# EasyEDA Pro project Pajero Gauges.epro, board PCB
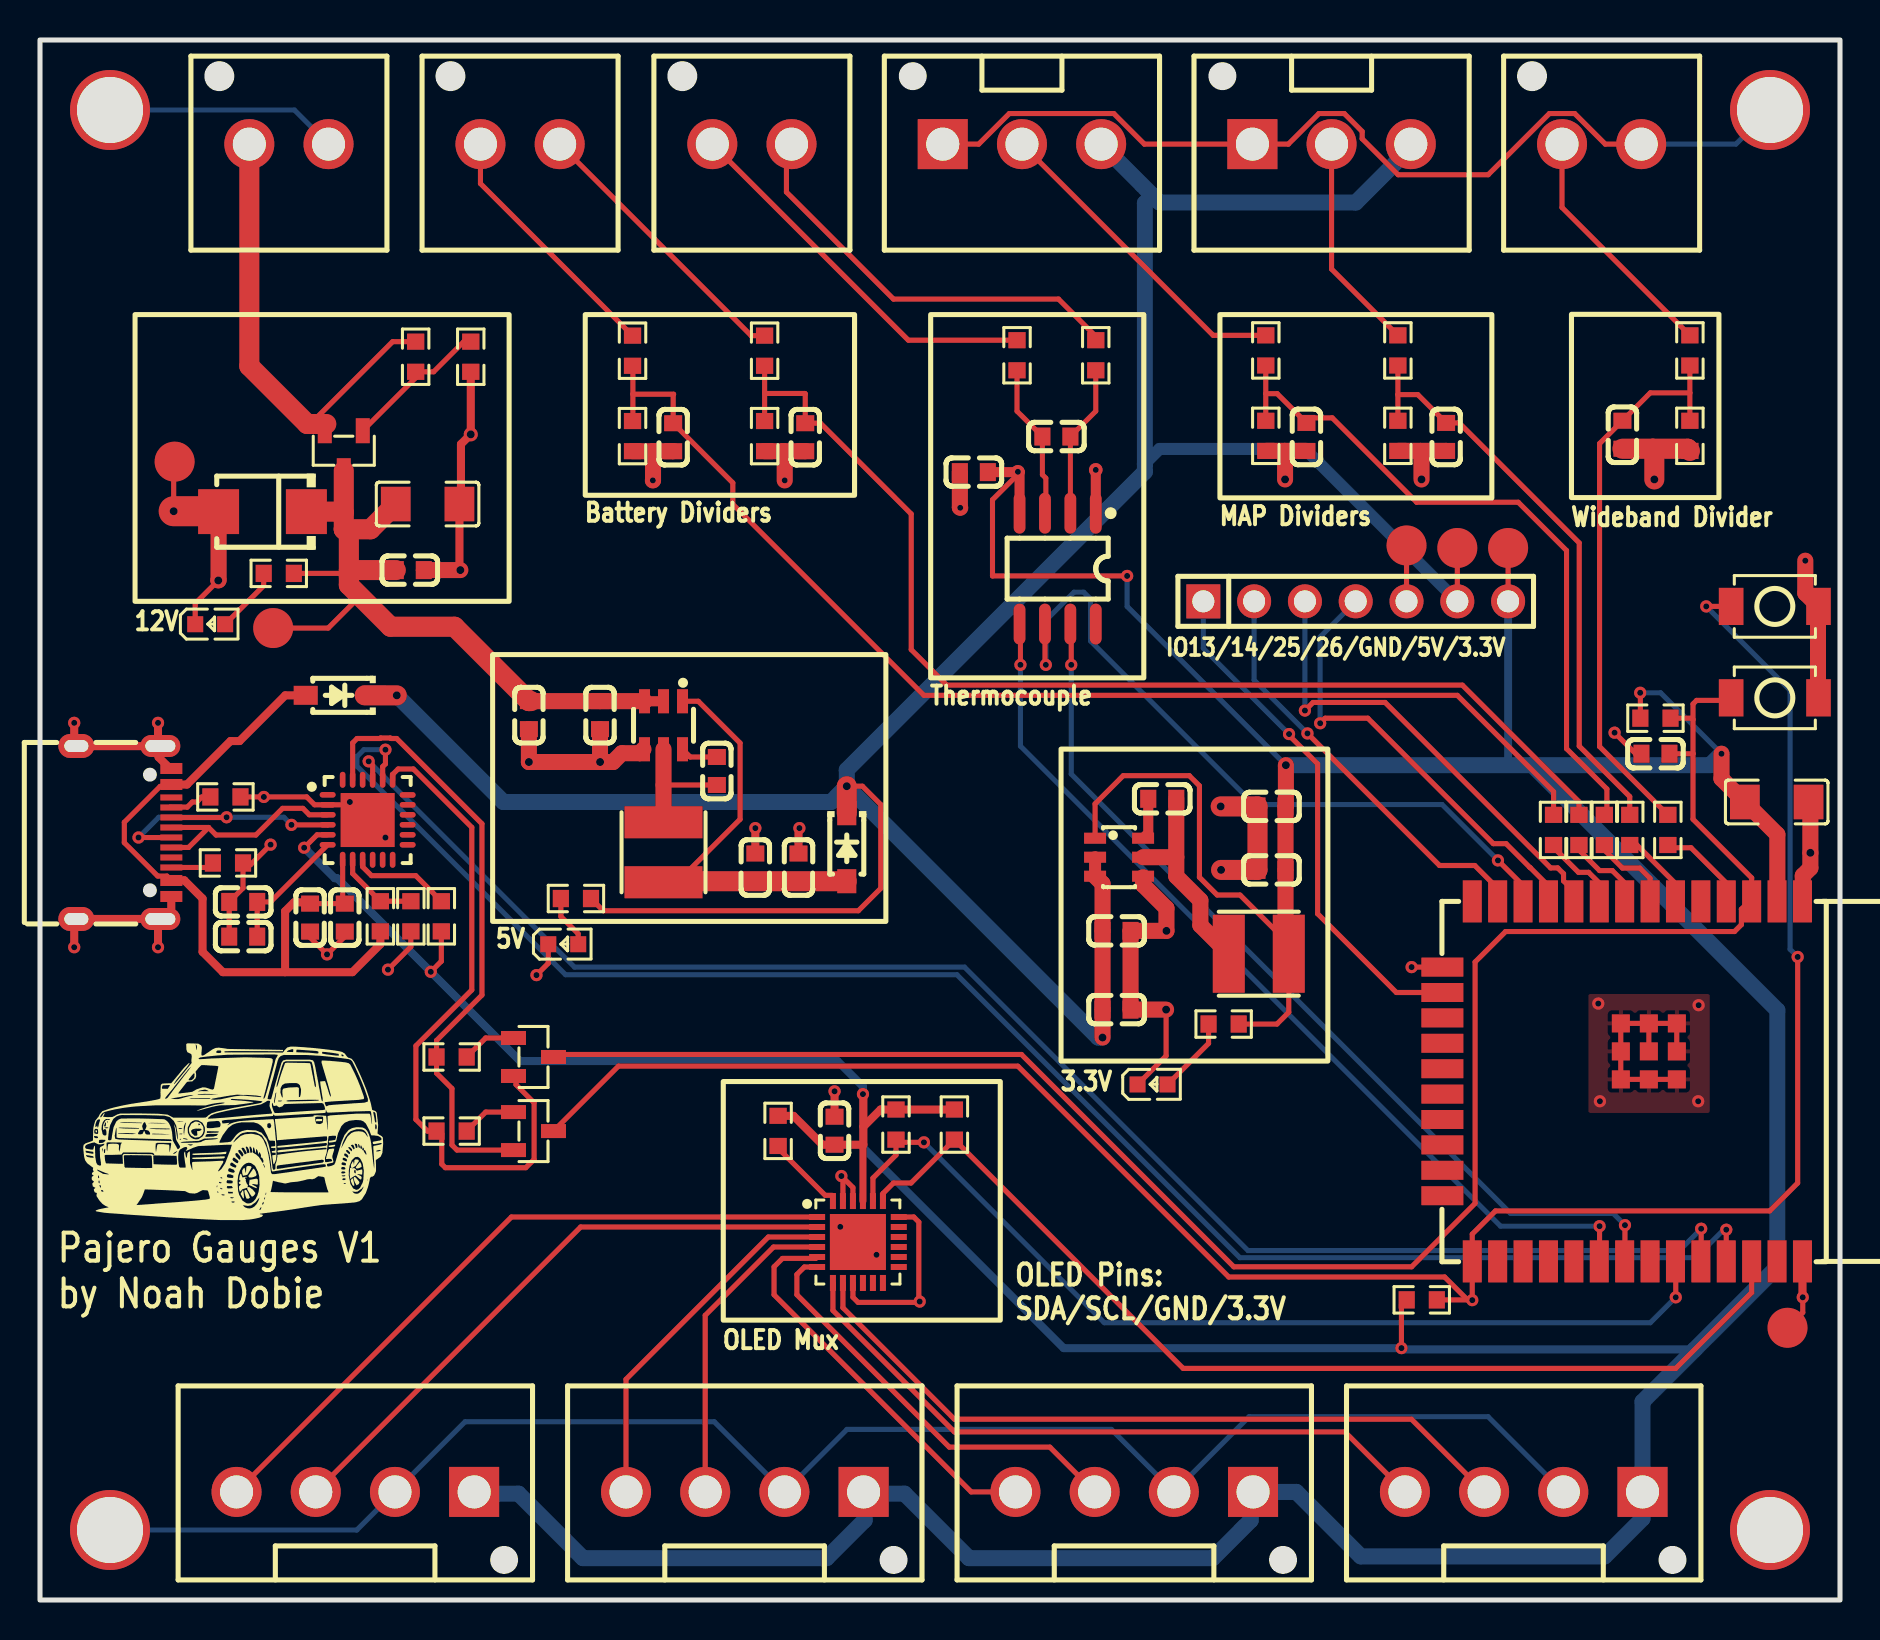
[diagram p18: board, top side]
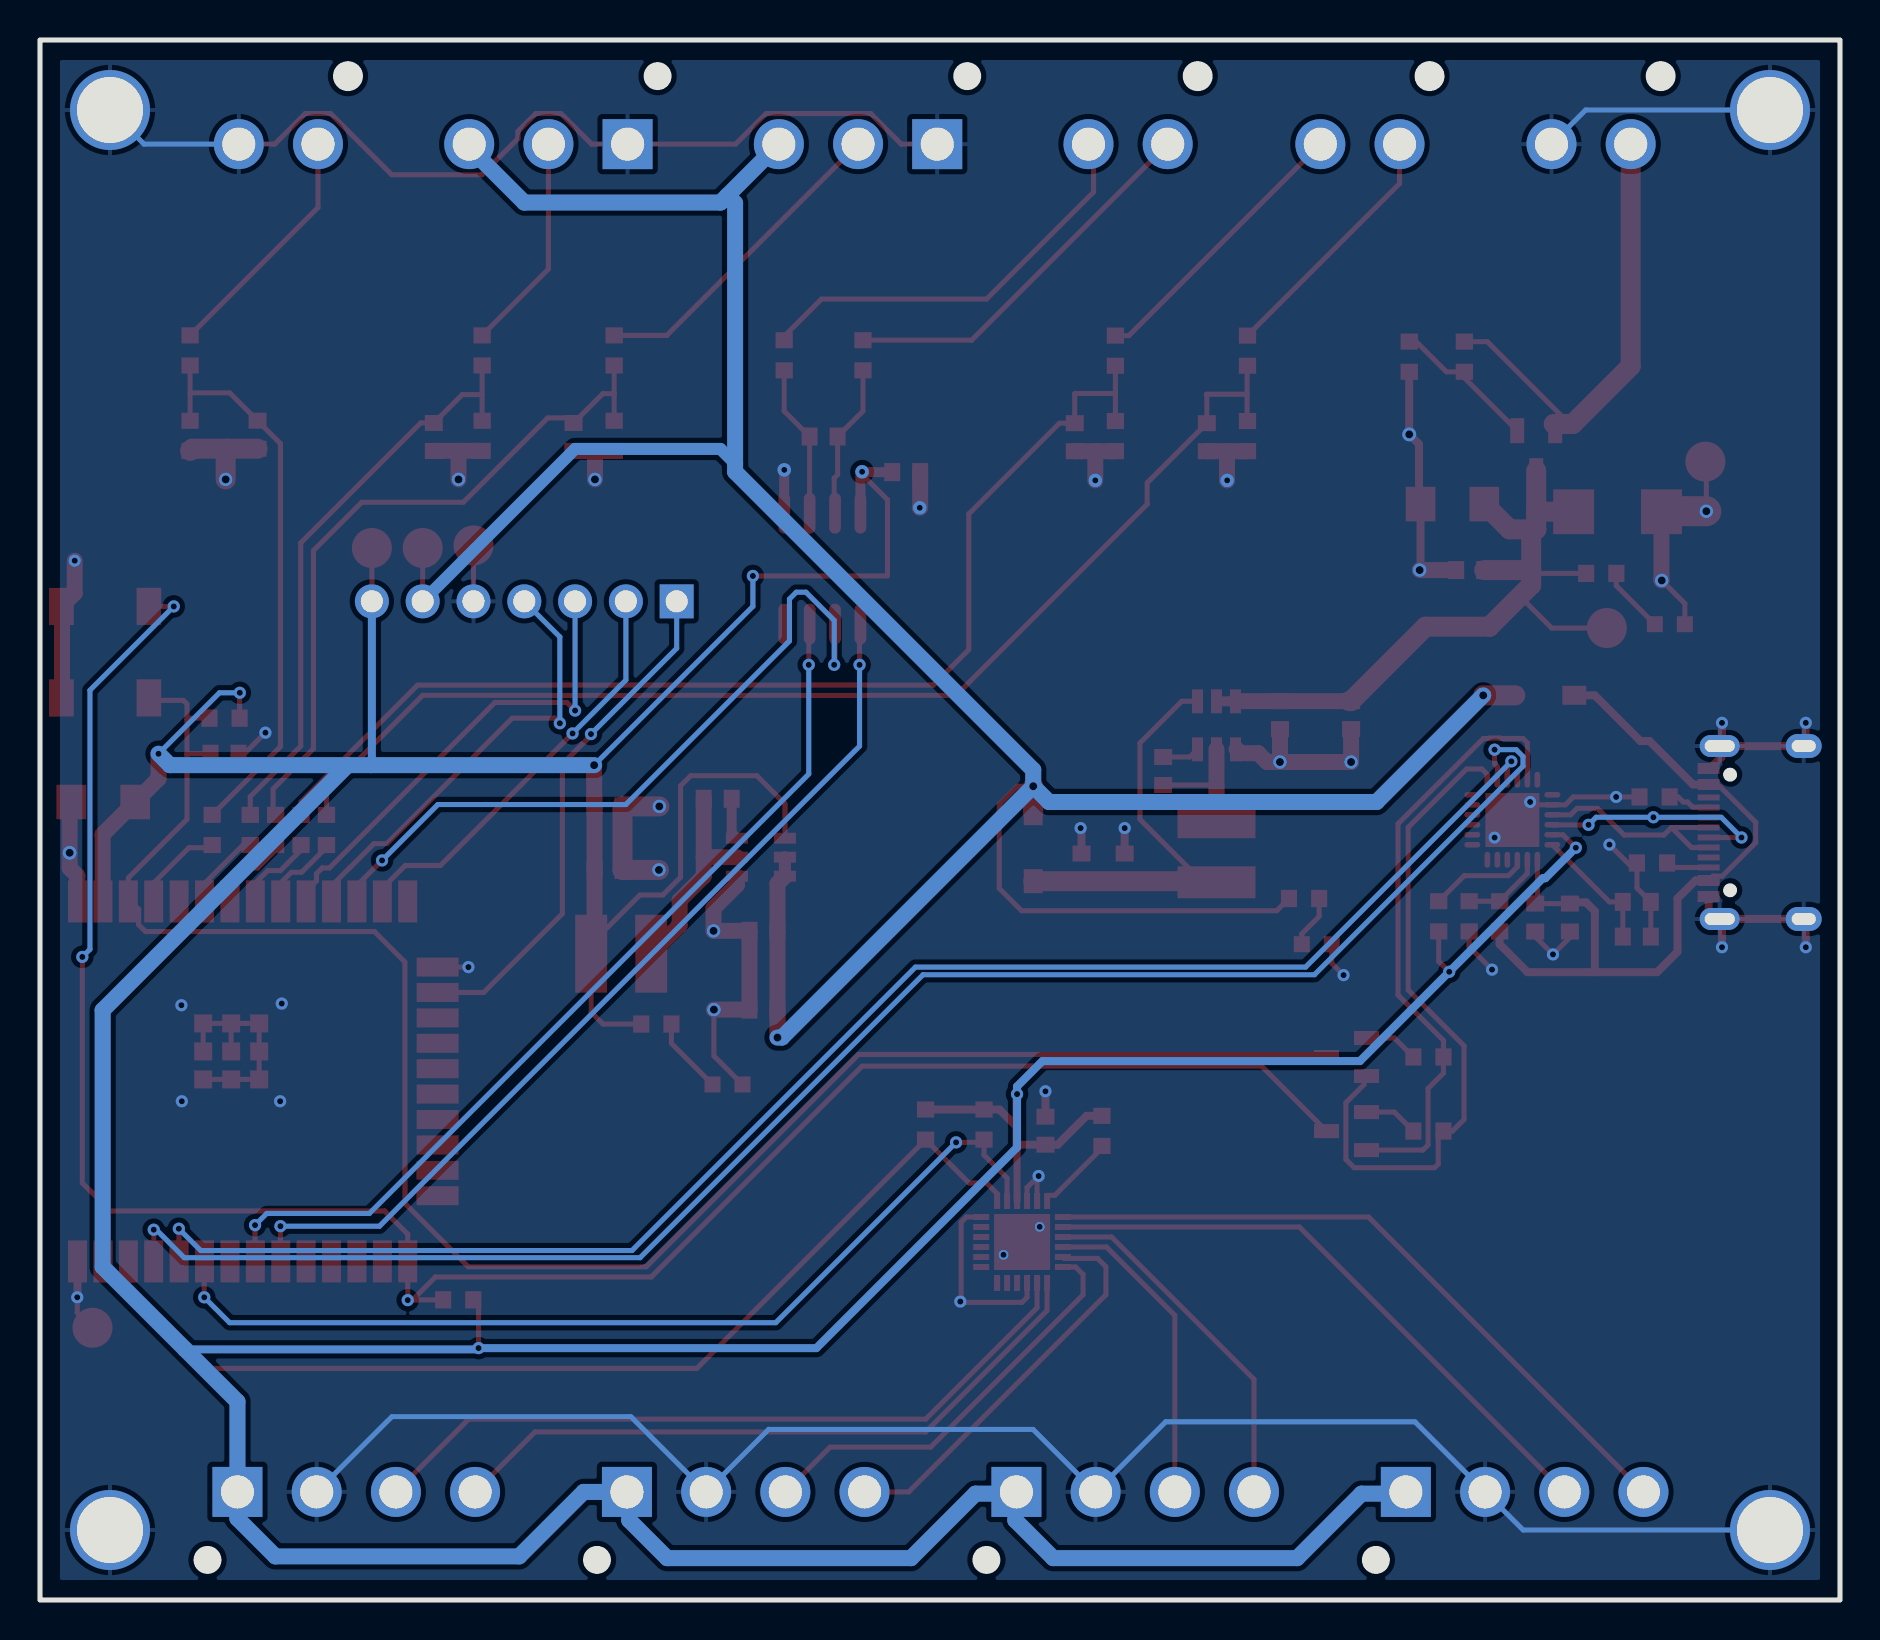
[diagram p19: board, bottom side, seen from below]

Outline 90 x 78 mm; copper layers: Top Layer, Bottom Layer. Coordinates in mm from the lower left corner of the outline.
Outline path: rectangle 0,78 90,0
Stack: Top Layer 0.035mm / Dielectric1 1.51mm FR4 er 4.5 / Bottom Layer 0.035mm

## Design rules (mm)
template: JLCPCB Capability(Two Layers Board)
spacing copperThickness1oz (default): track to track 0.102, other pairs 0.152 to 0.3
spacing copperThickness2oz: track to track 0.203, other pairs 0.152 to 0.3
track width copperThickness1oz (default): min 0.127, default 0.254, max 2.54
track width copperThickness2oz: min 0.203, default 0.254, max 2.54
differential pair differentialPair (default): width min 0.127, default 0.254, max 2.54; gap min 0.152, default 0.152
via viaSize (default): diameter min 0.5, default 0.61, max 10; hole min 0.3, default 0.305, max 6.3
net BATT_PROT uses copperThickness2oz
net IGN_12V uses copperThickness2oz
net TC+ uses copperThickness2oz
net TC- uses copperThickness2oz
net WB_OUT uses copperThickness2oz
net BATT1_IN uses copperThickness2oz
net BATT2_IN uses copperThickness2oz
net MAP1_SIGNAL_OUT uses copperThickness2oz
net MAP2_SIGNAL_OUT uses copperThickness2oz

## Placement (name value [footprint] x y rotation side)
C11  100nF  [C0603]  31.66 58.14 90 top
C12  100nF  [C0603]  38.26 58.14 90 top
C13  100nF  [C0603]  63.32 58.15 90 top
C14  100nF  [C0603]  70.31 58.15 90 top
C28  100uF  [C1206]  86.84 39.9 0 top
C31  100uF  [C1206]  19.38 54.8 0 top
C32  100nF  [C0603]  18.49 51.5 180 top
C33  100nF  [C0603]  56.11 40.06 180 top
C34  22uF  [C0603]  61.57 36.5 0 top
C35  22uF  [C0603]  61.57 39.68 180 top
C36  100nF  [C0603]  53.83 29.52 180 top
C37  100nF  [C0603]  53.83 33.46 180 top
C38  100nF  [C0603]  33.84 41.45 90 top
C39  22uF  [C0603]  35.77 36.62 270 top
C40  22uF  [C0603]  37.93 36.62 90 top
C41  100nF  [C0603]  24.44 44.24 90 top
C42  100nF  [C0603]  28 44.24 90 top
C43  10nF  [C0603]  50.82 58.17 0 top
C44  100nF  [C0603]  46.69 56.39 0 top
C49  100nF  [C0603]  79.12 58.26 90 top
C50  100nF  [C0603]  39.73 23.46 90 top
C51  1uF  [C0603]  80.77 42.31 180 top
C53  100nF  [C0603]  13.5 34.12 90 top
C54  4.7uF  [C0603]  15.24 34.12 90 top
C55  100nF  [C0603]  10.16 33.17 180 top
C56  4.7uF  [C0603]  10.16 34.9 180 top
D2  SMBJ58A  [SMB_L4.4-W3.6-LS5.2-RD]  11.12 54.42 180 top
D3  B5819W-G  [SOD-123_L2.7-W1.6-LS3.7-RD-1]  40.34 37.64 270 top
D4  B5819W-G  [SOD-123_L2.7-W1.6-LS3.7-RD-1]  14.99 45.23 180 top
ESP32  ESP32-WROOM-32E-N4  [WIFI-SMD_ESP32-WROOM-32E]  79.12 25.93 180 top
H1  B2P-VH-FB-B(LF)(SN)  [CONN-TH_2P-P3.96_B2P-VH-FB-B-LF-SN]  12.45 72.79 0 top
H3  B2P-VH-FB-B(LF)(SN)  [CONN-TH_2P-P3.96_B2P-VH-FB-B-LF-SN]  24 72.79 0 top
H4  B3P-VH-FB-B(LF)(SN)  [CONN-TH_B3P-VH-FB-B-LF-SN]  49.1 72.79 180 top
H5  B3P-VH-FB-B(LF)(SN)  [CONN-TH_B3P-VH-FB-B-LF-SN]  64.58 72.79 180 top
H6  B2P-VH-FB-B(LF)(SN)  [CONN-TH_2P-P3.96_B2P-VH-FB-B-LF-SN]  35.6 72.79 0 top
H7  B2P-VH-FB-B(LF)(SN)  [CONN-TH_2P-P3.96_B2P-VH-FB-B-LF-SN]  78.08 72.79 0 top
H8  B4P-VH-FB-B(LF)(SN)  [CONN-TH_B4P-VH-FB-B-LF-SN]  15.77 5.4 0 top
H9  B4P-VH-FB-B(LF)(SN)  [CONN-TH_B4P-VH-FB-B-LF-SN]  35.24 5.4 0 top
H10  B4P-VH-FB-B(LF)(SN)  [CONN-TH_B4P-VH-FB-B-LF-SN]  54.71 5.4 0 top
H11  B4P-VH-FB-B(LF)(SN)  [CONN-TH_B4P-VH-FB-B-LF-SN]  74.19 5.4 0 top
L4  4.7uH  [IND-SMD_L4.0-W4.0_FNR40XXS]  60.94 32.31 0 top
L5  4.7uH  [IND-SMD_L4.0-W4.0_FNR40XXS]  31.18 37.39 270 top
LED1  KT-0603R  [LED0603-RD]  8.51 48.79 0 top
LED2  KT-0603B  [LED0603-RD]  26.16 32.79 0 top
LED3  KT-0603G  [LED0603-RD]  55.63 25.78 0 top
NOREF  -  [Pad_e464]  6.73 56.92 0 top
NOREF#2  -  [Pad_e1928]  3.5 3.5 180 top
NOREF#3  -  [Pad_e454]  87.38 13.61 0 top
NOREF#4  -  [Pad_e1926]  86.5 74.5 0 top
NOREF#5  -  [Pad_e157]  3.5 74.5 90 top
NOREF#6  -  [Pad_e472]  70.87 52.6 0 top
NOREF#7  -  [Pad_e468]  68.33 52.73 0 top
NOREF#8  -  [Pad_e473]  73.41 52.6 0 top
NOREF#9  -  [Pad_e476]  11.66 48.6 0 top
NOREF#10  -  [Pad_e1927]  86.5 3.5 270 top
Q2  AO3401A  [SOT-23-3_L2.9-W1.3-P1.90-LS2.4-BR]  15.19 57.46 90 top
Q3  S8050  [SOT-23-3_L2.9-W1.3-P1.90-LS2.4-BR]  24.67 27.15 180 top
Q4  S8050  [SOT-23-3_L2.9-W1.3-P1.90-LS2.4-BR]  24.67 23.45 180 top
R4  1kΩ  [R0603]  79.49 38.5 270 top
R5  1kΩ  [R0603]  78.22 38.5 270 top
R6  1kΩ  [R0603]  76.95 38.5 270 top
R7  1kΩ  [R0603]  75.68 38.5 270 top
R9  100kΩ  [R0603]  21.54 62.16 90 top
R10  100kΩ  [R0603]  18.78 62.16 270 top
R11  100kΩ  [R0603]  52.79 62.24 270 top
R12  100kΩ  [R0603]  48.85 62.24 270 top
R13  1kΩ  [R0603]  81.39 38.5 270 top
R14  10kΩ  [R0603]  36.9 23.45 90 top
R15  4.7kΩ  [R0603]  42.8 23.77 270 top
R16  4.7kΩ  [R0603]  45.72 23.77 270 top
R17  10kΩ  [R0603]  80.77 44.09 180 top
R100  10kΩ  [R0603]  82.49 62.48 90 top
R101  20kΩ  [R0603]  82.49 58.21 90 top
R102  27kΩ  [R0603]  29.63 62.46 90 top
R103  5.1kΩ  [R0603]  29.63 58.19 90 top
R104  27kΩ  [R0603]  36.23 62.46 90 top
R105  5.1kΩ  [R0603]  36.23 58.19 90 top
R106  10kΩ  [R0603]  61.29 62.48 90 top
R107  20kΩ  [R0603]  61.29 58.21 90 top
R108  10kΩ  [R0603]  67.89 62.48 90 top
R109  20kΩ  [R0603]  67.89 58.21 90 top
R110  10kΩ  [R0603]  69.09 15.01 0 top
R111  4.7kΩ  [R0603]  11.94 51.33 180 top
R112  2.2kΩ  [R0603]  26.8 35.07 180 top
R113  1kΩ  [R0603]  59.18 28.8 180 top
R114  5.1kΩ  [R0603]  9.27 40.15 180 top
R115  5.1kΩ  [R0603]  9.4 36.85 0 top
R116  22.1kΩ  [R0603]  17.02 34.19 90 top
R117  47.5kΩ  [R0603]  18.54 34.19 90 top
R118  1kΩ  [R0603]  20.07 34.19 90 top
R119  12kΩ  [R0603]  20.58 27.15 0 top
R120  12kΩ  [R0603]  20.58 23.45 0 top
SW1  TS-1088-AR02016  [SW-SMD_L3.9-W3.0-P4.45]  86.74 45.11 0 top
SW2  TS-1088-AR02016  [SW-SMD_L3.9-W3.0-P4.45]  86.74 49.68 180 top
U10  AP63205WU-7  [TSOT-23-6_L2.9-W1.6-P0.95-LS2.8-BL]  31.18 43.74 180 top
U11  AP63203WU-7  [TSOT-26_L2.9-W1.6-P0.95-LS2.8-BL]  53.95 37.14 270 top
U12  MAX31855TASA+T  [SOIC-8_L4.9-W3.9-P1.27-LS6.2-BL]  50.88 51.57 180 top
U13  TCA9548ARGERQ1  [VQFN-24_L4.0-W4.0-P0.50-TL-EP2.8]  40.9 17.9 0 top
U14  CP2102N-A02-GQFN24R  [QFN-24_L4.0-W4.0-P0.50-TL-EP2.6]  16.38 39.01 0 top
U15  17-1442-002  [HDR-TH_7P-P2.54-V-M]  65.79 49.93 0 top
USB1  TYPE-C 16PIN 2MD(073)  [USB-C-SMD_TYPE-C-6PIN-2MD-073]  4.19 38.38 270 top

## Footprints (pads in the part's own frame, mm; a bottom-side part is the same pattern mirrored in y, then rotated)
C0603
  rect 0.8x0.9 smd: 1(-0.7,0) 2(0.7,0)
C1206
  rect 1.485x1.728 smd: 1(-1.593,0) 2(1.593,0)
CONN-TH_2P-P3.96_B2P-VH-FB-B-LF-SN
  round 2.5 hole 1.65: 1(-1.98,0) 2(1.98,0)
CONN-TH_B3P-VH-FB-B-LF-SN
  rect 2.5x2.5 hole 1.65: 1(3.96,0)
  round 2.5 hole 1.65: 2(0.001,0) 3(-3.96,0)
CONN-TH_B4P-VH-FB-B-LF-SN
  rect 2.5x2.5 hole 1.65: 1(5.94,0)
  round 2.5 hole 1.65: 2(1.98,0) 3(-1.98,0) 4(-5.94,0)
HDR-TH_7P-P2.54-V-M
  rect 1.7x1.7 hole 1.1: 1(-7.62,0)
  round 1.7 hole 1.1: 2(-5.08,0) 3(-2.54,0) 4(0,0) 5(2.54,0) 6(5.08,0) 7(7.62,0)
IND-SMD_L4.0-W4.0_FNR40XXS
  rect 1.6x3.9 smd: 1(-1.5,0) 2(1.5,0)
LED0603-RD
  rect 0.8x0.8 smd: 1(-0.749,0) 2(0.749,0)
Pad_e157
  round 4 hole 3.3: 1(0,0)
Pad_e454
  round 2 smd: 1(0,0)
Pad_e464
  round 2 smd: 1(0,0)
Pad_e468
  round 2 smd: 1(0,0)
Pad_e472
  round 2 smd: 1(0,0)
Pad_e473
  round 2 smd: 1(0,0)
Pad_e476
  round 2 smd: 1(0,0)
Pad_e1926
  round 4 hole 3.3: 1(0,0)
Pad_e1927
  round 4 hole 3.3: 1(0,0)
Pad_e1928
  round 4 hole 3.3: 1(0,0)
QFN-24_L4.0-W4.0-P0.50-TL-EP2.6
  oval 0.8x0.28 smd: 1(-2,1.25) 2(-2,0.75) 3(-2,0.25) 4(-2,-0.25) 5(-2,-0.75) 6(-2,-1.25) 13(2,-1.25) 14(2,-0.75) 15(2,-0.25) 16(2,0.25) 17(2,0.75) 18(2,1.242)
  oval 0.28x0.8 smd: 7(-1.25,-2) 8(-0.75,-2) 9(-0.25,-2) 10(0.25,-2) 11(0.75,-2) 12(1.25,-2) 19(1.25,2) 20(0.75,2) 21(0.25,2) 22(-0.25,2) 23(-0.75,2) 24(-1.25,2)
  rect 2.7x2.7 smd: 25(0,-0.013)
R0603
  rect 0.806x0.864 smd: 1(-0.753,0) 2(0.753,0)
SMB_L4.4-W3.6-LS5.2-RD
  rect 2.047x2.241 smd: 1(-2.195,0) 2(2.195,0)
SOD-123_L2.7-W1.6-LS3.7-RD-1
  rect 1.2x0.95 smd: 1(-1.7,0) 2(1.7,0)
SOIC-8_L4.9-W3.9-P1.27-LS6.2-BL
  oval 0.588x2.045 smd: 1(-1.905,-2.772) 2(-0.635,-2.772) 3(0.635,-2.772) 4(1.905,-2.772) 5(1.905,2.772) 6(0.635,2.772) 7(-0.635,2.772) 8(-1.905,2.772)
SOT-23-3_L2.9-W1.3-P1.90-LS2.4-BR
  rect 1.25x0.7 smd: 1(1,-0.95) 2(1,0.95) 3(-1,0)
SW-SMD_L3.9-W3.0-P4.45
  rect 1.23x1.86 smd: 1(-2.185,0) 2(2.185,0)
TSOT-23-6_L2.9-W1.6-P0.95-LS2.8-BL
  rect 0.55x1.2 smd: 1(-0.95,-1.2) 2(0,-1.2) 3(0.95,-1.2) 4(0.95,1.2) 5(0,1.2) 6(-0.95,1.2)
TSOT-26_L2.9-W1.6-P0.95-LS2.8-BL
  rect 0.55x1.1 smd: 1(-0.95,-1.2) 2(0,-1.2) 3(0.95,-1.2) 4(0.95,1.2) 5(0,1.2) 6(-0.95,1.2)
USB-C-SMD_TYPE-C-6PIN-2MD-073
  rect 0.55x1.1 smd: 1(-3.2,2.375) 2(-2.4,2.375) 11(2.4,2.375) 12(3.2,2.375)
  rect 0.3x1.1 smd: 3(-1.75,2.375) 4(-1.25,2.375) 5(-0.75,2.375) 6(-0.25,2.375) 7(0.25,2.375) 8(0.75,2.375) 9(1.25,2.375) 10(1.75,2.375)
  oval 1.1x2 hole 0.6x1.5: 13(-4.325,1.825) 14(4.325,1.825)
  oval 1.2x1.8 hole 0.6x1.2: 13(-4.325,-2.375) 14(4.325,-2.375)
VQFN-24_L4.0-W4.0-P0.50-TL-EP2.8
  rect 0.8x0.3 smd: 1(-2.042,1.25) 2(-2.042,0.75) 3(-2.042,0.25) 4(-2.042,-0.25) 5(-2.042,-0.75) 6(-2.042,-1.25) 13(2.042,-1.25) 14(2.042,-0.75) 15(2.042,-0.25) 16(2.042,0.25) 17(2.042,0.75) 18(2.042,1.25)
  rect 0.3x0.8 smd: 7(-1.25,-2.048) 8(-0.75,-2.048) 9(-0.25,-2.048) 10(0.249,-2.048) 11(0.75,-2.048) 12(1.25,-2.048) 19(1.25,2.048) 20(0.75,2.048) 21(0.249,2.048) 22(-0.25,2.048) 23(-0.75,2.048) 24(-1.25,2.048)
  rect 2.8x2.8 smd: 25(-0.001,-0.001)
WIFI-SMD_ESP32-WROOM-32E
  rect 0.95x2.1 smd: 1(-9.002,-9) 2(-7.732,-9) 3(-6.463,-9) 4(-5.192,-9) 5(-3.922,-9) 6(-2.652,-9) 7(-1.383,-9) 8(-0.113,-9) 9(1.157,-9) 10(2.428,-9) 11(3.697,-9) 12(4.968,-9) 13(6.237,-9) 14(7.508,-9) 25(7.508,9) 26(6.237,9) 27(4.968,9) 28(3.697,9) 29(2.428,9) 30(1.157,9) 31(-0.113,9) 32(-1.383,9) 33(-2.652,9) 34(-3.922,9) 35(-5.192,9) 36(-6.463,9) 37(-7.732,9) 38(-9.002,9)
  rect 2.1x0.95 smd: 15(9.002,-5.715) 16(9.002,-4.445) 17(9.002,-3.175) 18(9.002,-1.905) 19(9.002,-0.635) 20(9.002,0.635) 21(9.002,1.905) 22(9.002,3.175) 23(9.002,4.445) 24(9.002,5.715)
  rect 0.9x0.9 smd: 39(-2.721,-0.1) 39(-2.721,-1.5) 39(-2.721,-2.9) 39(-1.321,-0.1) 39(-1.321,-1.5) 39(-1.321,-2.9) 39(0.079,-0.1) 39(0.079,-1.5) 39(0.079,-2.9)

## Nets
As in the schematic, except:
+3.3V: C28.1 C34.2 C35.1 C44.2 C50.1 ESP32.2 H8.1 H9.1 H10.1 H11.1 L4.2 NOREF#8.1 R14.2 R15.1 R16.1 R17.2 R110.1 R113.1 R118.1 U11.1 U12.4 U13.21 U14.5 U15.7
+5V_RAIL: C36.2 C37.2 D3.1 D4.1 H4.3 H5.3 NOREF#6.1 R112.1 U11.2 U11.3 U15.6
PGND: C11.1 C12.1 C13.1 C14.1 C28.2 C31.2 C32.1 C34.1 C35.2 C36.1 C37.1 C39.1 C40.2 C41.1 C42.1 C44.1 C49.1 C50.2 C51.2 C53.1 C54.1 C55.2 C56.2 D2.2 ESP32.1 ESP32.15 ESP32.38 ESP32.39 H1.2 H4.1 H5.1 H7.2 H8.2 H9.2 H10.2 H11.2 LED1.1 LED2.1 LED3.1 NOREF.1 NOREF#2.1 NOREF#3.1 NOREF#4.1 NOREF#5.1 NOREF#7.1 NOREF#10.1 R9.1 R101.1 R103.1 R105.1 R107.1 R109.1 R114.1 R115.2 R117.1 SW1.2 SW2.1 U10.4 U11.4 U12.1 U13.9 U13.18 U13.22 U13.23 U13.25 U14.2 U14.25 U15.5 USB1.1 USB1.12 USB1.13 USB1.14
BATT_PROT: C31.1 C32.2 C41.2 C42.2 D2.1 NOREF#9.1 Q2.3 R111.1 U10.2 U10.3

Pads without a net: ESP32 5 14 17 18 19 20 21 22 23 24 26 27 28 29 32 37; U12 8; U13 10 11 12 13 14 15 16 17; U14 1 10 11 12 13 14 15 16 17 18 22 24; USB1 3 9

## Via types
v1: diameter 0.5, hole 0.3, Top Layer to Bottom Layer, 2 vias
v2: diameter 0.68, hole 0.3, Top Layer to Bottom Layer, 5 vias
v3: diameter 0.61, hole 0.305, Top Layer to Bottom Layer, 53 vias
v4: diameter 0.7, hole 0.4, Top Layer to Bottom Layer, 5 vias
v5: diameter 0.68, hole 0.4, Top Layer to Bottom Layer, 13 vias

## Routing (per net, layer and track width the routed paths; a pad name or vN(x,y) marks a point on that pad's centre or on a via; arc(x,y) is an arc through that point)
3.3VBUCK_BST: length 2.1
  Top Layer w0.5: U11.6 55.41,38.35 C33.2
3.3VBUCK_SW_TOIND: length 10.5
  Top Layer w0.8: 56.81,37.14 56.81,36.19 58.02,34.98 58.02,33.73 L4.1 ; 56.81,37.14 C33.1 ; 56.81,37.14 U11.5
5VBUCK_BST: length 1.9
  Top Layer w0.254: U10.6 32.51,42.15 C38.2
5VBUCK_SW_TOIND: length 6.3
  Top Layer w0.254: 31.18,40.73 31.19,40.75 C38.1
  Top Layer w0.8: U10.5 L5.1
+3.3V: length 325.1
  Top Layer w0.254: R17.2 80.02,45.35 v3(80.01,45.36) ; R110.1 68.07,14.75 v3(68.07,12.59) ; R113.1 61.85,28.8 62.44,29.39 L4.2 ; v3(19.54,31.41) 20.07,31.94 R118.1 ; 48.88,56.27 47.62,55.01 47.62,51.2 v3(54.36,51.2) ; U15.7 NOREF#8.1 ; U11.1 52.75,39.81 54.16,41.22 57.46,41.22 57.97,40.71 57.97,36.14 58.86,35.25 60,35.25 62.27,32.98 ; U14.5 13.86,38.26 v3(13.21,37.61)
  Top Layer w0.35: U13.21 41.15,22.74 41.17,22.76
  Top Layer w0.4: v3(41.15,25.3) 41.17,25.27 41.17,23.67 ; 41.17,23.67 41.17,22.76 C50.1 39.12,22.76 37.67,24.21 R14.2 ; 41.17,23.67 42.03,24.52 R15.1 R16.1
  Top Layer w0.5: U12.4 48.98,56.4 48.98,56.39 C44.2
  Top Layer w0.8: v3(84.07,42.31) 84.07,41.07 C28.1 86.87,38.27 86.87,34.94 ESP32.2 ; 62.27,32.98 C34.2 C35.1 62.29,39.7 v4(62.29,41.74)
  Bottom Layer w0.254: v3(54.36,51.2) 54.36,49.68 v4(62.29,41.74) ; v3(80.01,45.36) 81.03,45.36 v3(84.07,42.31)
  Bottom Layer w0.4: 73.45,41.74 73.41,41.78 U15.7 ; v3(13.21,37.61) 14.73,36.09 14.86,36.09 v3(19.54,31.41) 24,26.95 39.88,26.95 41.15,25.68 v3(41.15,25.3) 41.15,22.63 51.18,12.59 v3(68.07,12.59) 68.14,12.53 82.74,12.53
  Bottom Layer w0.8: 60.54,5.32 60.54,3.99 58.64,2.09 46.45,2.09 43.23,5.32 41.23,5.32 ; 41.23,5.32 41.06,5.32 ; 41.23,5.32 41.23,3.99 39.34,2.09 27.15,2.09 23.92,5.32 21.76,5.32 ; 74.61,41.74 86.87,29.49 86.87,16.66 80.13,9.92 H11.1 80.13,4.07 78.23,2.18 66.04,2.18 62.82,5.4 H10.1 ; 74.61,41.74 v4(62.29,41.74) ; 74.61,41.74 83.5,41.74 v3(84.07,42.31)
  vias: v2(48.9,56.41)
+5V_RAIL: length 152.2
  Top Layer w0.254: U15.6 NOREF#6.1 ; R112.1 28.16,34.46 40.92,34.46 42.04,35.58 42.04,39.77 41.12,40.69 v5(40.34,40.69)
  Top Layer w0.6: U11.2 U11.3
  Top Layer w0.8: v4(53.13,28.12) C36.2 C37.2 53.13,35.82 U11.3
  Top Layer w1: 16.24,45.23 v4(17.84,45.23) ; D3.1 v5(40.34,40.69)
  Bottom Layer w0.6: U15.6 63.25,57.55 55.98,57.55 55.25,56.82
  Bottom Layer w0.8: 55.63,70.22 55.25,69.84 55.25,56.41 40.34,41.5 v5(40.34,40.69) ; 55.63,70.22 55.98,69.87 65.79,69.87 68.54,72.63 H5.3 ; 55.63,70.22 53.06,72.79 ; v5(40.34,40.69) 52.91,28.12 v4(53.13,28.12) ; v5(40.34,40.69) 39.55,39.9 23.17,39.9 v4(17.84,45.23)
PGND: length 302.5
  Top Layer w0.254: 43.94,14.88 43.94,18.9 43.69,19.15 U13.18 ; 43.94,14.88 43.94,14.84 43.9,14.88 40.9,14.88 40.65,15.14 U13.9 ; 43.94,14.88 v3(43.98,14.92) ; LED3.1 56.31,27.21 v5(56.31,29.52) ; 40.15,21.12 v3(40.07,21.2) ; 40.15,21.12 U13.23 ; 40.15,21.12 40.65,20.62 U13.22 ; LED1.1 7.76,49.82 v5(8.91,50.98) ; NOREF.1 6.68,56.87 v5(6.68,54.44) ; 10.26,36.76 10.52,36.76 v3(11.53,37.77) ; 70.12,31.64 v3(68.58,31.64) ; C51.2 79.78,42.31 v3(78.73,43.37) ; ESP32.39 81.84,28.83 81.84,27.43 ; ESP32.39 79.04,28.83 79.04,26.03 ; ESP32.39 ESP32.39 ; v3(17.4,31.52) 18.54,32.66 R117.1 ; NOREF#3.1 88.14,14.37 v3(88.14,15.13) ; 80.06,72.79 78.26,72.79 76.73,74.32 75.47,74.32 72.41,71.26 67.91,71.26 66.11,73.06 66.11,73.43 65.21,74.32 63.95,74.32 62.42,72.79 H5.1 55.22,72.79 53.69,74.32 48.46,74.32 46.94,72.79 H4.1 ; R115.2 10.15,35.6 C56.2 C55.2 ; v3(24.82,31.24) 25.41,31.83 25.41,32.79 ; 11.19,40.15 13.33,40.15 13.73,39.76 U14.2 15.36,39.76 v3(15.49,39.9) ; ESP32.39 ESP32.39 ESP32.39 ; R114.1 11.19,40.15 ; C54.1 15.24,33.17 v3(14.35,32.28) 13.5,33.13 C53.1 ; U15.5 NOREF#7.1
  Top Layer w0.4: R9.1 v4(21.54,58.28) 21.05,57.79 21.05,54.87 C31.2 20.97,51.54 v5(21.02,51.5) ; C39.1 v3(35.77,38.59) ; 5.94,42.69 5.9,42.73 v3(5.9,43.86) ; 6.56,35.18 6.56,34.06 6,34.06 ; C40.2 37.93,38.55 v3(37.97,38.59) ; v3(5.9,32.64) 5.9,34.02 ; 6.5,41.57 5.93,42.14 5.93,42.69 1.75,42.69 1.71,42.73 v3(1.71,43.86) ; v3(88.14,15.13) 88.12,15.15 ESP32.38 ; 1.67,34.06 1.71,34.02 v3(1.71,32.64) ; 5.86,34.05 1.75,34.05 ; v3(39.73,25.43) C50.2
  Top Layer w0.5: U12.1 v2(52.79,56.51)
  Top Layer w0.8: 62.24,57.46 R107.1 ; 62.24,57.46 62.25,57.45 v5(62.25,56.03) ; 62.24,57.46 63.32,57.46 ; C12.1 38.26,57.44 37.17,57.44 ; 88.9,49.7 88.9,45.13 SW1.2 ; 88.9,49.7 88.26,50.34 v3(88.26,51.97) ; 88.9,49.7 SW2.1 ; C14.1 70.3,57.46 69.02,57.46 ; R105.1 37.17,57.44 ; 37.17,57.44 37.24,57.38 v2(37.24,55.98) ; v5(28,41.9) v5(24.44,41.9) C41.1 ; v5(28,41.9) 28.65,41.9 29.09,42.34 29.98,42.34 30.17,42.54 ; v5(28,41.9) 28,41.9 C42.1 ; v2(46.01,54.61) 45.99,54.63 C44.1 ; 30.65,57.44 31.66,57.44 C11.1 ; 30.65,57.44 R103.1 ; 30.65,57.44 30.65,55.99 v2(30.64,55.98) ; 69.02,57.46 69.08,57.4 v5(69.08,56.03) ; 69.02,57.46 R109.1 ; 55.15,36.14 55.15,35.76 56.32,34.59 v5(56.32,33.46) C37.1 C36.1 v5(56.31,29.52) ; D2.2 8.93,50.99 v5(8.91,50.98) ; C32.1 v5(21.02,51.5) ; C28.2 88.52,39.81 v4(88.52,37.36) 88.52,36.6 88.14,36.22 88.14,34.94 ESP32.1
  Top Layer w1: 80.64,57.56 80.72,57.49 v5(80.72,56.03) ; 80.64,57.56 82.39,57.56 R101.1 ; 80.64,57.56 C49.1 ; v5(59.03,39.68) C35.2 C34.1 v5(59.05,36.5)
  Top Layer w1.5: v5(6.68,54.44) 8.91,54.44 D2.2
  Bottom Layer w0.254: H11.2 72.41,9.17 60.45,9.17 H10.2 53.57,8.53 40.35,8.53 H9.2 33.71,8.91 21.25,8.91 H8.2 15.84,3.5 NOREF#2.1 ; NOREF#4.1 84.79,72.79 H7.2 ; H1.2 12.72,74.5 NOREF#5.1
  vias: v1(40.01,18.66) v1(41.83,17.26) v3(11.19,40.15) v3(17.27,38.12) v3(77.91,29.82) v3(77.99,24.94) v3(82.93,29.74) v3(82.91,24.94)
BATT1_IN: length 12.7
  Top Layer w0.254: H3.1 22.02,70.82 R102.2
BATT1_STPDWN: length 59.7
  Top Layer w0.254: 29.64,60.29 31.68,60.29 31.66,60.27 C11.2 34.64,55.86 34.64,54.79 44.2,45.23 70.87,45.23 75.68,40.42 R7.1 ; 29.64,60.29 29.64,61.69 R102.1 ; 29.64,60.29 29.64,58.97 R103.2
BATT2_IN: length 14.2
  Top Layer w0.254: R104.2 35.56,63.22 H3.2
BATT2_STPDWN: length 57.5
  Top Layer w0.254: R104.1 36.23,60.39 36.3,60.33 ; 36.3,60.33 38.24,60.33 38.26,60.31 C12.2 39.02,58.84 43.56,54.3 43.56,47.52 45.34,45.74 71.12,45.74 76.95,39.91 R6.1 ; 36.3,60.33 36.23,60.33 R105.2
BATT_PROT: length 38.7
  Top Layer w0.254: 15.75,49.93 14.41,48.6 NOREF#9.1 ; R111.1 15.28,51.33
  Top Layer w0.5: U10.2 U10.3
  Top Layer w0.8: 24.54,44.94 C42.2 30.22,44.94 U10.3
  Top Layer w1: 15.74,51.5 15.44,51.2 15.44,50.75 17.53,48.66 20.73,48.66 C41.2 24.54,44.94 ; 15.74,51.5 15.44,51.5 15.44,53.28 15.19,53.54 ; 15.74,51.5 C32.2 ; 15.19,53.54 15.19,54.39 ; 15.19,53.54 16.52,53.54 C31.1 ; 15.19,54.39 15.16,54.42 D2.1 ; 15.19,54.39 Q2.3
BUCK_5V: length 21.1
  Top Layer w0.254: U10.1 32.92,44.94 35,42.85 35,39.04 32.03,36.07 32.03,35.94
  Top Layer w1: D3.2 31.23,35.94 L5.2
DTR: length 30.7
  Top Layer w0.254: U14.23 15.63,42.86 15.85,43.08 17,43.08 17.03,43.1 17.51,43.1 17.54,43.08 17.83,43.08 22.1,38.81 22.1,30.25 19.83,27.98 R119.1 19.83,26.34 20.6,25.57 20.6,22.75 20.85,22.5 Q4.2
ESP32_EN: length 94.9
  Top Layer w0.254: C51.1 82.64,42.31 82.65,42.32 ; 82.65,42.32 82.65,39.04 85.58,36.1 ESP32.3 85.46,34.93 85.07,34.54 85.07,33.76 84.73,33.42 73.28,33.42 71.75,31.9 71.75,19.83 68.58,16.66 59.69,16.66 49.07,27.28 25.8,27.28 Q3.3 ; 82.65,42.32 82.65,44.03 ; SW1.1 84.43,44.98 82.83,44.98 82.65,44.8 82.65,44.03 ; 82.65,44.03 82.59,44.09 R17.1
ESP32_GPIO0: length 106.3
  Top Layer w0.254: 71.37,15.01 71.6,15.01 v3(71.61,14.99) ESP32.25 71.61,18.3 72.77,19.45 86.49,19.45 87.88,20.85 v3(87.88,32.15) ; 71.37,15.01 R110.2 ; 71.37,15.01 70.23,16.15 59.44,16.15 48.9,26.69 28.92,26.69 Q4.3 ; SW2.2 v3(83.31,49.68)
  Bottom Layer w0.254: v3(87.88,32.15) 87.5,32.53 87.5,45.49 v3(83.31,49.68)
ESP32_IO32: length 4.1
  Top Layer w0.254: R6.2 76.95,37.5 77.98,36.47 78.61,36.47 79.23,35.85 ESP32.8
ESP32_IO33: length 4.1
  Top Layer w0.254: R7.2 75.68,37.63 76.92,36.38 77.43,36.38 77.98,35.84 77.98,34.94 ESP32.9
ESP32_IO34: length 4
  Top Layer w0.254: R4.2 79.85,37.75 81.77,35.82 ESP32.6
ESP32_IO35: length 4.3
  Top Layer w0.254: R5.2 78.22,37.5 79.12,36.6 79.99,36.6 80.5,36.08 ESP32.7
ESP32_SENSOR_VP: length 4.6
  Top Layer w0.254: ESP32.4 84.31,35.85 82.55,37.61 81.53,37.61 R13.2
GPIO13: length 25.9
  Top Layer w0.254: ESP32.16 67.82,30.38 63.88,34.31 63.88,41.81 62.45,43.23 v3(62.45,43.3)
  Bottom Layer w0.254: v3(62.45,43.3) 58.17,47.58 U15.1
GPIO14: length 21.1
  Top Layer w0.254: ESP32.13 72.88,35.58 71.74,36.72 69.98,36.72 v3(63.37,43.33)
  Bottom Layer w0.254: U15.2 60.71,46 v3(63.37,43.33)
GPIO25: length 23.7
  Top Layer w0.254: ESP32.10 76.69,35.44 76.18,35.95 76.18,36.31 75.89,36.6 75.53,36.6 67.25,44.88 63.65,44.88 v3(63.25,44.47)
  Bottom Layer w0.254: v3(63.25,44.47) U15.3
GPIO26: length 22.6
  Top Layer w0.254: ESP32.11 75.42,35.71 74.51,36.62 74.5,36.62 73.3,37.82 72.66,37.82 66.39,44.09 64.26,44.09 v3(64.01,43.84)
  Bottom Layer w0.254: U15.4 64.01,48.16 v3(64.01,43.84)
IGN_12V: length 23.1
  Top Layer w0.254: R10.1 17.63,62.92 13.52,58.8
  Top Layer w1: 14.31,58.8 13.36,58.8 10.47,61.69 H1.1
MAP1_SIGNAL_OUT: length 16.2
  Top Layer w0.254: H4.2 58.66,63.23 R106.2
MAP1_STPDWN: length 35.4
  Top Layer w0.254: 61.29,60.32 R106.1 ; 61.29,60.32 R107.2 ; 61.29,60.32 61.86,60.32 63.32,58.85 63.58,59.11 64.61,59.11 68.83,54.89 73.91,54.89 76.33,52.47 76.33,42.57 78.34,40.55 78.34,39.38 R5.1
MAP2_SIGNAL_OUT: length 10.9
  Top Layer w0.254: R108.2 64.58,66.55 H5.2
MAP2_STPDWN: length 29.5
  Top Layer w0.254: 67.89,60.27 68.89,60.27 70.31,58.85 70.96,58.85 76.96,52.85 76.96,42.69 79.49,40.17 R4.1 ; 67.89,60.27 R109.2 ; 67.89,60.27 R108.1
MOS_G: length 7.4
  Top Layer w0.254: R9.2 21.19,62.92 19.68,61.41 R10.2 18.78,61.11 Q2.1
MUX_RESET: length 3.7
  Top Layer w0.254: 39.62,20.23 39.26,20.23 36.91,22.58
MUX_SCL: length 52.8
  Top Layer w0.254: U13.19 42.15,20.32 42.67,20.85 43.55,20.85 R16.2 57.16,11.58 81.79,11.58 85.58,15.37 ESP32.36
MUX_SDA: length 48.7
  Top Layer w0.254: U13.20 41.65,21.09 42.8,22.25 R15.2 42.93,22.88 v3(44.2,22.88) ; ESP32.33 81.79,16.92 v3(81.79,15.13)
  Bottom Layer w0.254: v3(44.2,22.88) 53.21,13.87 80.52,13.87 v3(81.79,15.13)
OLED1_SCL: length 30.6
  Top Layer w0.254: 13.79,5.4 27.03,18.65 U13.2
OLED1_SDA: length 34.7
  Top Layer w0.254: H8.4 23.57,19.15 U13.1
OLED2_SCL: length 15.8
  Top Layer w0.254: H9.3 33.26,14.23 36.68,17.65 U13.4
OLED2_SDA: length 18.1
  Top Layer w0.254: H9.4 29.3,11.03 36.42,18.15 U13.3
OLED3_SCL: length 21.1
  Top Layer w0.254: U13.6 38.22,16.65 37.85,16.28 37.85,15.26 45.47,7.64 50.5,7.64 H10.3
OLED3_SDA: length 19.9
  Top Layer w0.254: U13.5 38.78,17.08 37.12,17.08 36.7,16.66 36.7,15.26 46.56,5.4 H10.4
OLED4_SCL: length 37.1
  Top Layer w0.254: H11.3 68.57,9.04 45.72,9.04 40.15,14.61 U13.8
OLED4_SDA: length 33.7
  Top Layer w0.254: H11.4 65.25,8.4 45.72,8.4 39.65,14.48 U13.7
RTS: length 33.7
  Top Layer w0.254: 19.95,23.45 20.09,23.31 20.09,21.79 20.27,21.61 24.29,21.61 24.7,22.03 24.7,24.86 23.8,25.77 23.8,26.2 ; R120.1 19.38,23.45 18.8,24.03 18.8,27.71 21.59,30.5 21.59,38.63 18.67,41.55 17.91,41.55 17.63,41.28 U14.19
RXD: length 79.9
  Top Layer w0.254: v3(83.06,18.56) 83.06,16.94 ESP32.34 ; U14.21 16.63,41.73 v3(16.43,41.93)
  Bottom Layer w0.254: v3(16.43,41.93) 26.72,31.64 46.23,31.64 60.4,17.47 81.97,17.47 v3(83.06,18.56)
TC+: length 19.3
  Top Layer w0.254: H6.1 43.42,62.99 R12.1
TC+AFTERPULLUP: length 7.9
  Top Layer w0.25: U12.3 50.12,54.47 50.12,55.07 50.29,55.24 50.29,56.09 50.12,56.27 C43.1 48.85,59.44 R12.2
TC-: length 21.2
  Top Layer w0.254: R11.1 52.79,63.18 50.93,65.05 42.67,65.05 37.32,70.4 37.32,72.54 H6.2
TC-AFTERPULLUP: length 7.7
  Top Layer w0.25: R11.2 52.79,59.44 C43.2 51.52,54.34
TC_CS: length 36.8
  Top Layer w0.25: U12.6 50.25,46.8
  Top Layer w0.254: v3(72.9,36.98) 74.15,35.72 ESP32.12
  Bottom Layer w0.254: v3(50.29,46.76) 50.29,48.98 51.7,50.39 52.19,50.39 52.53,50.05 52.53,47.95 60.71,39.77 70.1,39.77 v3(72.9,36.98)
TC_SCK: length 46.8
  Top Layer w0.25: v3(49.02,46.76) 49.02,48.75 U12.5
  Top Layer w0.254: v3(77.98,18.69) 77.98,16.94 ESP32.30
  Bottom Layer w0.254: v3(77.98,18.69) 73.03,18.69 49.02,42.69 v3(49.02,46.76)
TC_SO: length 46.4
  Top Layer w0.25: U12.7 51.56,48.75 v3(51.56,46.76)
  Top Layer w0.254: ESP32.31 79.25,16.94 v3(79.25,18.74)
  Bottom Layer w0.254: v3(79.25,18.74) 78.66,19.33 73.53,19.33 51.56,41.3 v3(51.56,46.76)
TXD: length 84.4
  Top Layer w0.254: v3(17.27,42.52) 17.27,41.81 17.13,41.67 U14.20 ; v3(84.31,18.51) ESP32.35
  Bottom Layer w0.254: v3(84.31,18.51) 84.19,18.51 82.79,17.12 60,17.12 45.85,31.26 26.28,31.26 15.85,41.69 15.85,42.17 16.19,42.52 v3(17.27,42.52)
USB_5V: length 39.5
  Top Layer w0.254: 6.56,40.77 6.31,40.77 6.22,40.68 6.01,40.68 4.22,38.89 4.22,37.87 5.88,36.2 6.34,36.2 USB1.11 ; C53.2 C54.2 15.13,34.93 U14.7
  Top Layer w0.4: R116.1 17.02,32.79 15.62,31.39 12.26,31.39 ; 6.57,40.77 7.35,40.77 9.53,42.95 9.98,42.95 12.26,45.23 D4.2 ; USB1.11 6.57,35.98 7.22,35.98 8.13,35.07 8.13,32.41 9.14,31.39 12.26,31.39 ; 12.26,31.39 12.26,34.44 12.7,34.88 13.44,34.88 C53.2
USB_CC1: length 2.2
  Top Layer w0.254: 8.45,40.15 8.09,40.15 7.84,39.9 7.62,39.9 7.36,39.64 6.52,39.64 6.5,39.62
USB_CC2: length 2.2
  Top Layer w0.254: 6.56,36.63 8.42,36.63 R115.1
USB_D+: length 10.9
  Top Layer w0.254: 6.56,37.63 7.43,37.63 8.43,38.63 ; 8.43,38.63 8.8,38.25 10.8,38.25 12.13,39.58 13.14,39.58 13.47,39.26 U14.3 ; 8.43,38.63 6.56,38.63
USB_D-: length 14.4
  Top Layer w0.254: 6.5,39.12 9.32,39.12 v3(9.33,39.14) ; 6.5,38.12 v3(4.93,38.12) ; U14.4 14.38,38.76 v3(12.57,38.76)
  Bottom Layer w0.254: v3(12.57,38.76) 12.19,39.14 v3(9.33,39.14) 5.94,39.14 v3(4.93,38.12)
WB_OUT: length 12.2
  Top Layer w0.254: 76.1,72.79 76.1,69.62 R100.2
WB_STPDWN: length 28.3
  Top Layer w0.25: 82.49,60.36 80.51,60.36 C49.2 ; 82.49,60.36 R101.2 ; 82.49,60.36 R100.1
  Top Layer w0.254: C49.2 77.98,57.82 77.98,42.67 R13.1
$2N5399: length 3.3
  Top Layer w0.254: R111.2 11.18,50.72 LED1.2
$3N5671: length 3.9
  Top Layer w0.254: LED3.2 58.43,27.83 R113.2
$9N1468: length 2.6
  Top Layer w0.254: R112.2 26.04,34.18 26.91,33.31 LED2.2
$11N880: length 4.2
  Top Layer w0.254: R117.2 R116.2 15.63,36.32 U14.8
$11N883: length 6.4
  Top Layer w0.254: U14.6 11.53,34.9 C56.1 C55.1
$11N890: length 5
  Top Layer w0.254: R118.2 18.79,36.22 16.57,36.22 16.13,36.66 U14.9
$11N1237: length 2.7
  Top Layer w0.254: 21.33,27.15 22.28,28.1 Q3.1
$11N1363: length 2.7
  Top Layer w0.254: 21.33,23.45 22.28,24.4 Q4.1

## Copper pours and planes (outline as drawn; the poured copper is in the pictures)
PGND on Top Layer: 39.41,19.42 42.33,19.42 42.33,16.37 39.41,16.37
PGND on Top Layer: 77.47,30.25 83.44,30.25 83.44,24.41 77.47,24.41
PGND on Top Layer: 14.99,40.41 17.78,40.41 17.78,37.61 14.99,37.61
PGND on Bottom Layer: 1,77 89,77 89,1 1,1

## Text on the board
Top Silkscreen Layer: IO13/14/25/26/GND/5V/3.3V | 12V | 5V | OLED Mux | Wideband Divider | 3.3V | Thermocouple | Battery Dividers | MAP Dividers | OLED Pins: / SDA/SCL/GND/3.3V | by Noah Dobie | Pajero Gauges V1
